# EAGLE schematic AccessPanelV1 (EAGLE 7.3.0)
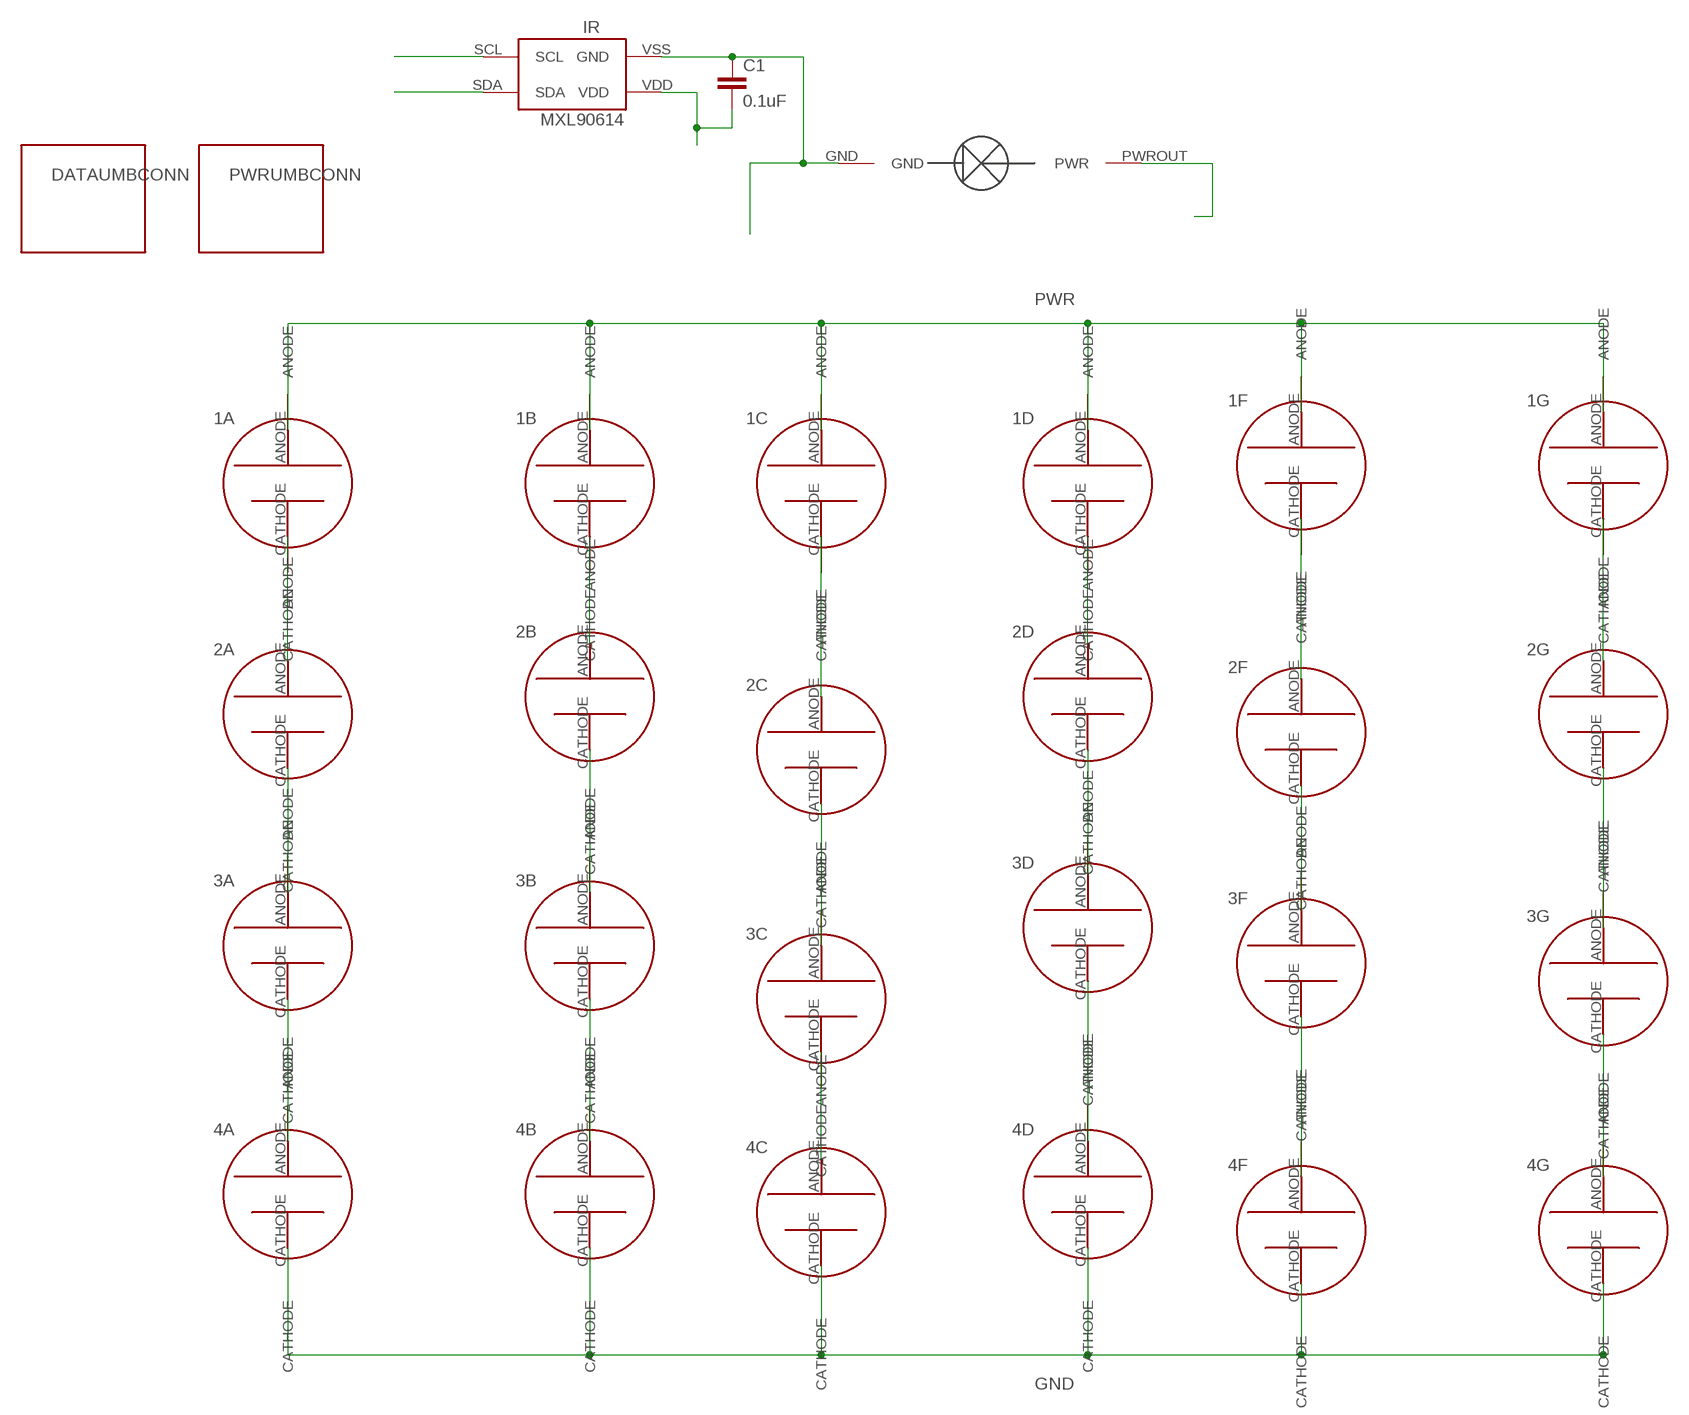
[diagram p0: schematic, sheet 1]

## Parts
1A  NEWSOLARPANEL  [SOLARCELL2]
1B  NEWSOLARPANEL  [SOLARCELL2]
1C  NEWSOLARPANEL  [SOLARCELL2]
1D  NEWSOLARPANEL  [SOLARCELL2]
1F  NEWSOLARPANEL  [SOLARCELL2]
1G  NEWSOLARPANEL  [SOLARCELL2]
2A  NEWSOLARPANEL  [SOLARCELL2]
2B  NEWSOLARPANEL  [SOLARCELL2]
2C  NEWSOLARPANEL  [SOLARCELL2]
2D  NEWSOLARPANEL  [SOLARCELL2]
2F  NEWSOLARPANEL  [SOLARCELL2]
2G  NEWSOLARPANEL  [SOLARCELL2]
3A  NEWSOLARPANEL  [SOLARCELL2]
3B  NEWSOLARPANEL  [SOLARCELL2]
3C  NEWSOLARPANEL  [SOLARCELL2]
3D  NEWSOLARPANEL  [SOLARCELL2]
3F  NEWSOLARPANEL  [SOLARCELL2]
3G  NEWSOLARPANEL  [SOLARCELL2]
4A  NEWSOLARPANEL  [SOLARCELL2]
4B  NEWSOLARPANEL  [SOLARCELL2]
4C  NEWSOLARPANEL  [SOLARCELL2]
4D  NEWSOLARPANEL  [SOLARCELL2]
4F  NEWSOLARPANEL  [SOLARCELL2]
4G  NEWSOLARPANEL  [SOLARCELL2]
C1  0.1uF  CAP0805  [0805]
DATAUMBCONN  HARWIN_PWR_BOARDMOUNT  [HARWIN_PWR_BOARDMOUNT]
IR  MXL90620  [MXL90614]
PHD  PHOTODETECTOR  [PHOTODECTORDEVICE2]
PWRUMBCONN  HARWIN_PWR_BOARDMOUNT  [HARWIN_PWR_BOARDMOUNT]

## Nets
3V3: C1.2 IR.VDD
GND: 4A.CATHODE 4B.CATHODE 4C.CATHODE 4D.CATHODE 4F.CATHODE 4G.CATHODE C1.1 IR.VSS(GND) PHD.GND
N$1: 2A.CATHODE 3A.ANODE
N$2: 1C.CATHODE 2C.ANODE
N$3: 2B.CATHODE 3B.ANODE
N$4: 2C.CATHODE 3C.ANODE
N$5: 2D.CATHODE 3D.ANODE
N$6: 3C.CATHODE 4C.ANODE
N$8: 2F.CATHODE 3F.ANODE
N$9: 1B.CATHODE 2B.ANODE
N$10: 2G.CATHODE 3G.ANODE
N$11: 3G.CATHODE 4G.ANODE
N$12: 1D.CATHODE 2D.ANODE
N$13: 3F.CATHODE 4F.ANODE
N$15: 3D.CATHODE 4D.ANODE
N$16: 3B.CATHODE 4B.ANODE
N$17: 3A.CATHODE 4A.ANODE
N$18: 1A.CATHODE 2A.ANODE
N$24: 1G.CATHODE 2G.ANODE
N$32: 1F.CATHODE 2F.ANODE
PDOUT: PHD.PWROUT(PWR)
PWR: 1A.ANODE 1B.ANODE 1C.ANODE 1D.ANODE 1F.ANODE 1G.ANODE
SCL: IR.SCL
SDA: IR.SDA

## Library data of the parts
1A 1B 1C 1D 1F 1G 2A 2B 2C 2D 2F 2G 3A 3B 3C 3D 3F 3G 4A 4B 4C 4D 4F 4G = solarcellnew:NEWSOLARPANEL
C1 = CNTRL_BOARD:CAP: Capacitor Standard 0603 ceramic capacitor, and 0.1" leaded capacitor.
DATAUMBCONN PWRUMBCONN = CNTRL_BOARD:HARWIN_PWR_BOARDMOUNT
IR = CNTRL_BOARD:MXL90620
PHD = solarcellnew:PHOTODETECTOR

## Net classes
0 default: width 0.635 mm, drill 0.508 mm, clearance 0.254 mm